# Altium schematic sheet 15_SOLENOID 2.SchDoc
size 420 x 297 mm; SheetNumber: 24; SheetTotal: 29
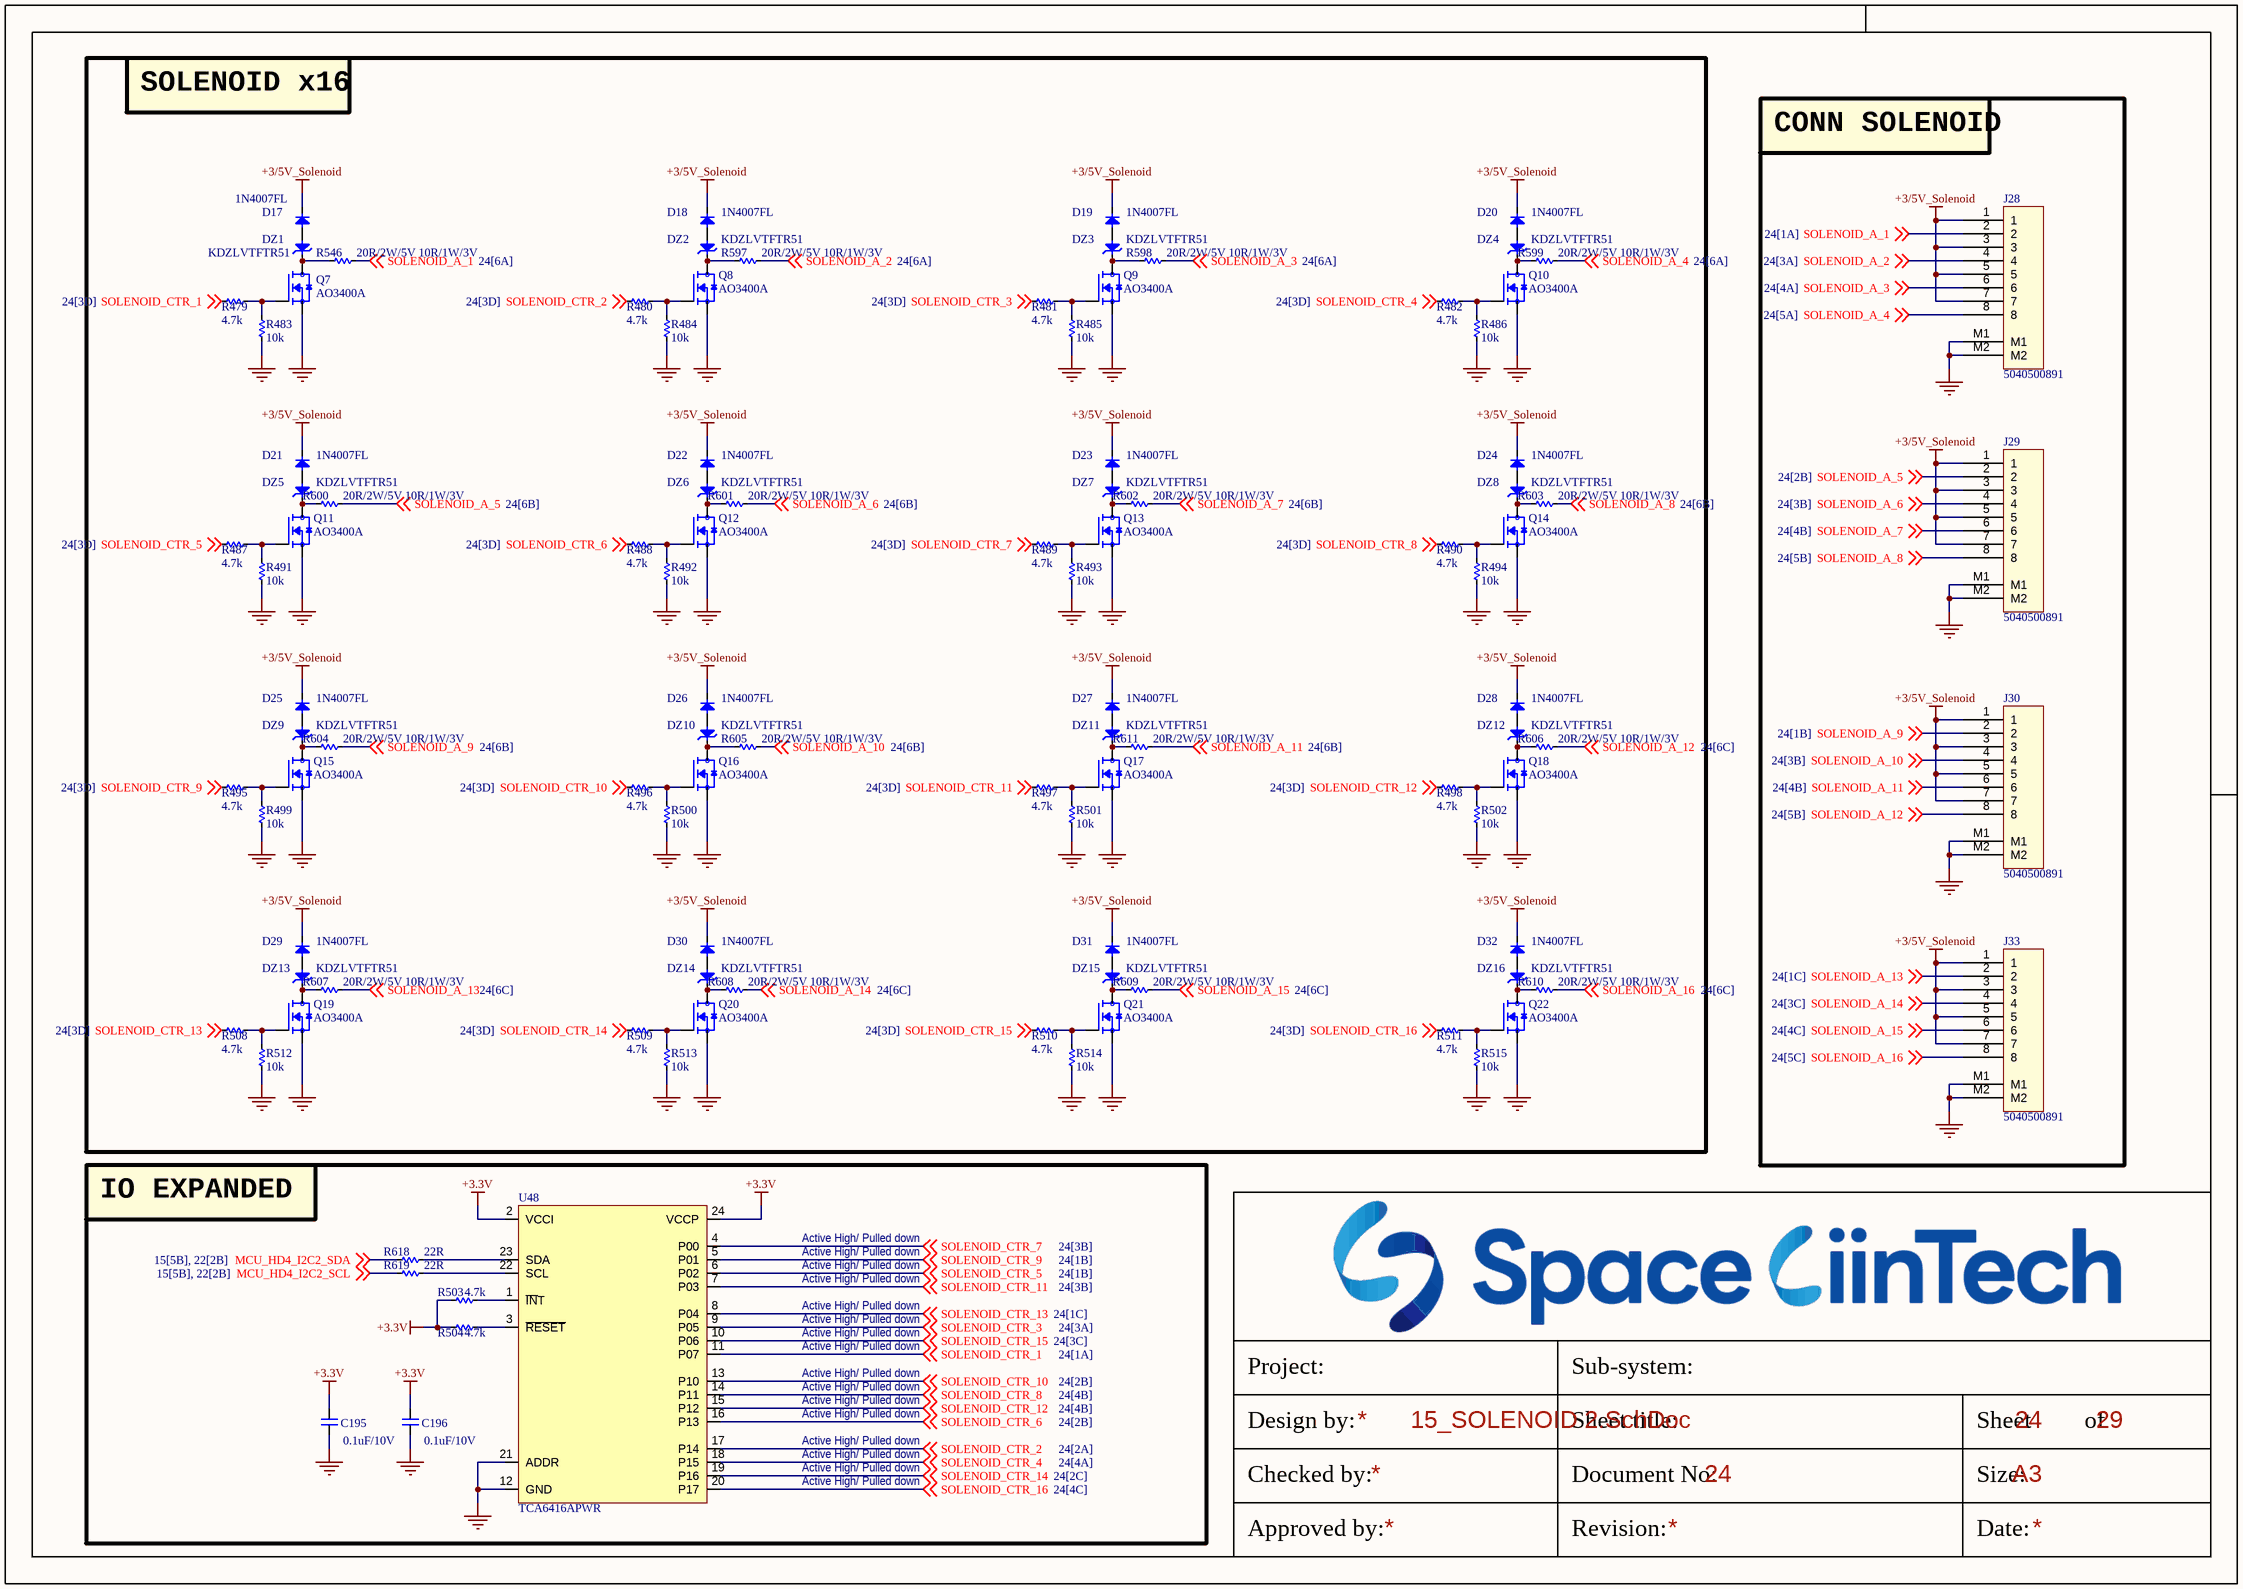
[diagram p0: 15_SOLENOID 2.SchDoc]

## Parts
C195  0.1uF/10V  [CAP_C_1005X60]
C196  0.1uF/10V  [CAP_C_1005X60]
D17  1N4007FL  [SOD3717X145N]
D18  1N4007FL  [SOD3717X145N]
D19  1N4007FL  [SOD3717X145N]
D20  1N4007FL  [SOD3717X145N]
D21  1N4007FL  [SOD3717X145N]
D22  1N4007FL  [SOD3717X145N]
D23  1N4007FL  [SOD3717X145N]
D24  1N4007FL  [SOD3717X145N]
D25  1N4007FL  [SOD3717X145N]
D26  1N4007FL  [SOD3717X145N]
D27  1N4007FL  [SOD3717X145N]
D28  1N4007FL  [SOD3717X145N]
D29  1N4007FL  [SOD3717X145N]
D30  1N4007FL  [SOD3717X145N]
D31  1N4007FL  [SOD3717X145N]
D32  1N4007FL  [SOD3717X145N]
DZ1  KDZLVTFTR51  [SOD3717X145N]
DZ2  KDZLVTFTR51  [SOD3717X145N]
DZ3  KDZLVTFTR51  [SOD3717X145N]
DZ4  KDZLVTFTR51  [SOD3717X145N]
DZ5  KDZLVTFTR51  [SOD3717X145N]
DZ6  KDZLVTFTR51  [SOD3717X145N]
DZ7  KDZLVTFTR51  [SOD3717X145N]
DZ8  KDZLVTFTR51  [SOD3717X145N]
DZ9  KDZLVTFTR51  [SOD3717X145N]
DZ10  KDZLVTFTR51  [SOD3717X145N]
DZ11  KDZLVTFTR51  [SOD3717X145N]
DZ12  KDZLVTFTR51  [SOD3717X145N]
DZ13  KDZLVTFTR51  [SOD3717X145N]
DZ14  KDZLVTFTR51  [SOD3717X145N]
DZ15  KDZLVTFTR51  [SOD3717X145N]
DZ16  KDZLVTFTR51  [SOD3717X145N]
J28  5040500891  [MOLEX_5040500891]
J29  5040500891  [MOLEX_5040500891]
J30  5040500891  [MOLEX_5040500891]
J33  5040500891  [MOLEX_5040500891]
Q7  AO3400A  [SOT95P240X120-3N]
Q8  AO3400A  [SOT95P240X120-3N]
Q9  AO3400A  [SOT95P240X120-3N]
Q10  AO3400A  [SOT95P240X120-3N]
Q11  AO3400A  [SOT95P240X120-3N]
Q12  AO3400A  [SOT95P240X120-3N]
Q13  AO3400A  [SOT95P240X120-3N]
Q14  AO3400A  [SOT95P240X120-3N]
Q15  AO3400A  [SOT95P240X120-3N]
Q16  AO3400A  [SOT95P240X120-3N]
Q17  AO3400A  [SOT95P240X120-3N]
Q18  AO3400A  [SOT95P240X120-3N]
Q19  AO3400A  [SOT95P240X120-3N]
Q20  AO3400A  [SOT95P240X120-3N]
Q21  AO3400A  [SOT95P240X120-3N]
Q22  AO3400A  [SOT95P240X120-3N]
R479  4.7k  [RES_C_1005X40]
R480  4.7k  [RES_C_1005X40]
R481  4.7k  [RES_C_1005X40]
R482  4.7k  [RES_C_1005X40]
R483  10k  [RES_C_1005X40]
R484  10k  [RES_C_1005X40]
R485  10k  [RES_C_1005X40]
R486  10k  [RES_C_1005X40]
R487  4.7k  [RES_C_1005X40]
R488  4.7k  [RES_C_1005X40]
R489  4.7k  [RES_C_1005X40]
R490  4.7k  [RES_C_1005X40]
R491  10k  [RES_C_1005X40]
R492  10k  [RES_C_1005X40]
R493  10k  [RES_C_1005X40]
R494  10k  [RES_C_1005X40]
R495  4.7k  [RES_C_1005X40]
R496  4.7k  [RES_C_1005X40]
R497  4.7k  [RES_C_1005X40]
R498  4.7k  [RES_C_1005X40]
R499  10k  [RES_C_1005X40]
R500  10k  [RES_C_1005X40]
R501  10k  [RES_C_1005X40]
R502  10k  [RES_C_1005X40]
R503  4.7k  [RES_C_1005X40]
R504  4.7k  [RES_C_1005X40]
R508  4.7k  [RES_C_1005X40]
R509  4.7k  [RES_C_1005X40]
R510  4.7k  [RES_C_1005X40]
R511  4.7k  [RES_C_1005X40]
R512  10k  [RES_C_1005X40]
R513  10k  [RES_C_1005X40]
R514  10k  [RES_C_1005X40]
R515  10k  [RES_C_1005X40]
R546  20R/2W/5V 10R/1W/3V  [RES_C_6331X65_N]
R597  20R/2W/5V 10R/1W/3V  [RES_C_6331X65_N]
R598  20R/2W/5V 10R/1W/3V  [RES_C_6331X65_N]
R599  20R/2W/5V 10R/1W/3V  [RES_C_6331X65_N]
R600  20R/2W/5V 10R/1W/3V  [RES_C_6331X65_N]
R601  20R/2W/5V 10R/1W/3V  [RES_C_6331X65_N]
R602  20R/2W/5V 10R/1W/3V  [RES_C_6331X65_N]
R603  20R/2W/5V 10R/1W/3V  [RES_C_6331X65_N]
R604  20R/2W/5V 10R/1W/3V  [RES_C_6331X65_N]
R605  20R/2W/5V 10R/1W/3V  [RES_C_6331X65_N]
R606  20R/2W/5V 10R/1W/3V  [RES_C_6331X65_N]
R607  20R/2W/5V 10R/1W/3V  [RES_C_6331X65_N]
R608  20R/2W/5V 10R/1W/3V  [RES_C_6331X65_N]
R609  20R/2W/5V 10R/1W/3V  [RES_C_6331X65_N]
R610  20R/2W/5V 10R/1W/3V  [RES_C_6331X65_N]
R611  20R/2W/5V 10R/1W/3V  [RES_C_6331X65_N]
R618  22R  [RES_C_1005X40]
R619  22R  [RES_C_1005X40]
U48  TCA6416APWR  [SOP65P440W-24N]

## Blocks framed on the sheet
SOLENOID x16: D17-D32 DZ1-DZ16 Q7-Q22 R479-R502 R508-R515 R546 R597-R611
CONN SOLENOID: J28-J30 J33
IO EXPANDED: C195 C196 R503 R504 R618 R619 U48

## Nets
+3.3V: C195.2 C196.2 R503.1 R504.1 U48.2(VCCI) U48.24(VCCP)
+3/5V_Solenoid: D17.1(K) D18.1(K) D19.1(K) D20.1(K) D21.1(K) D22.1(K) D23.1(K) D24.1(K) D25.1(K) D26.1(K) D27.1(K) D28.1(K) D29.1(K) D30.1(K) D31.1(K) D32.1(K) J28.1 J28.3 J28.5 J28.7 J29.1 J29.3 J29.5 J29.7 J30.1 J30.3 J30.5 J30.7 J33.1 J33.3 J33.5 J33.7
GND: C195.1 C196.1 J28.M1 J28.M2 J29.M1 J29.M2 J30.M1 J30.M2 J33.M1 J33.M2 Q7.2(S) Q8.2(S) Q9.2(S) Q10.2(S) Q11.2(S) Q12.2(S) Q13.2(S) Q14.2(S) Q15.2(S) Q16.2(S) Q17.2(S) Q18.2(S) Q19.2(S) Q20.2(S) Q21.2(S) Q22.2(S) R483.1 R484.1 R485.1 R486.1 R491.1 R492.1 R493.1 R494.1 R499.1 R500.1 R501.1 R502.1 R512.1 R513.1 R514.1 R515.1 U48.12(GND) U48.21(ADDR)
MCU_HD4_I2C2_SCL: R619.2 ; off-sheet MCU_HD4_I2C2_SCL
MCU_HD4_I2C2_SDA: R618.2 ; off-sheet MCU_HD4_I2C2_SDA
SOLENOID_A_1: J28.2 R546.1 ; off-sheet SOLENOID_A_1
SOLENOID_A_2: J28.4 R597.1 ; off-sheet SOLENOID_A_2
SOLENOID_A_3: J28.6 R598.1 ; off-sheet SOLENOID_A_3
SOLENOID_A_4: J28.8 R599.1 ; off-sheet SOLENOID_A_4
SOLENOID_A_5: J29.2 R600.1 ; off-sheet SOLENOID_A_5
SOLENOID_A_6: J29.4 R601.1 ; off-sheet SOLENOID_A_6
SOLENOID_A_7: J29.6 R602.1 ; off-sheet SOLENOID_A_7
SOLENOID_A_8: J29.8 R603.1 ; off-sheet SOLENOID_A_8
SOLENOID_A_9: J30.2 R604.1 ; off-sheet SOLENOID_A_9
SOLENOID_A_10: J30.4 R605.1 ; off-sheet SOLENOID_A_10
SOLENOID_A_11: J30.6 R611.1 ; off-sheet SOLENOID_A_11
SOLENOID_A_12: J30.8 R606.1 ; off-sheet SOLENOID_A_12
SOLENOID_A_13: J33.2 R607.1 ; off-sheet SOLENOID_A_13
SOLENOID_A_14: J33.4 R608.1 ; off-sheet SOLENOID_A_14
SOLENOID_A_15: J33.6 R609.1 ; off-sheet SOLENOID_A_15
SOLENOID_A_16: J33.8 R610.1 ; off-sheet SOLENOID_A_16
SOLENOID_CTR_1: R479.2 U48.11(P07) ; off-sheet SOLENOID_CTR_1
SOLENOID_CTR_2: R480.2 U48.17(P14) ; off-sheet SOLENOID_CTR_2
SOLENOID_CTR_3: R481.2 U48.9(P05) ; off-sheet SOLENOID_CTR_3
SOLENOID_CTR_4: R482.2 U48.18(P15) ; off-sheet SOLENOID_CTR_4
SOLENOID_CTR_5: R487.2 U48.6(P02) ; off-sheet SOLENOID_CTR_5
SOLENOID_CTR_6: R488.2 U48.16(P13) ; off-sheet SOLENOID_CTR_6
SOLENOID_CTR_7: R489.2 U48.4(P00) ; off-sheet SOLENOID_CTR_7
SOLENOID_CTR_8: R490.2 U48.14(P11) ; off-sheet SOLENOID_CTR_8
SOLENOID_CTR_9: R495.2 U48.5(P01) ; off-sheet SOLENOID_CTR_9
SOLENOID_CTR_10: R496.2 U48.13(P10) ; off-sheet SOLENOID_CTR_10
SOLENOID_CTR_11: R497.2 U48.7(P03) ; off-sheet SOLENOID_CTR_11
SOLENOID_CTR_12: R498.2 U48.15(P12) ; off-sheet SOLENOID_CTR_12
SOLENOID_CTR_13: R508.2 U48.8(P04) ; off-sheet SOLENOID_CTR_13
SOLENOID_CTR_14: R509.2 U48.19(P16) ; off-sheet SOLENOID_CTR_14
SOLENOID_CTR_15: R510.2 U48.10(P06) ; off-sheet SOLENOID_CTR_15
SOLENOID_CTR_16: R511.2 U48.20(P17) ; off-sheet SOLENOID_CTR_16
NetD17_2: D17.2(A) DZ1.2(A)
NetD18_2: D18.2(A) DZ2.2(A)
NetD19_2: D19.2(A) DZ3.2(A)
NetD20_2: D20.2(A) DZ4.2(A)
NetD21_2: D21.2(A) DZ5.2(A)
NetD22_2: D22.2(A) DZ6.2(A)
NetD23_2: D23.2(A) DZ7.2(A)
NetD24_2: D24.2(A) DZ8.2(A)
NetD25_2: D25.2(A) DZ9.2(A)
NetD26_2: D26.2(A) DZ10.2(A)
NetD27_2: D27.2(A) DZ11.2(A)
NetD28_2: D28.2(A) DZ12.2(A)
NetD29_2: D29.2(A) DZ13.2(A)
NetD30_2: D30.2(A) DZ14.2(A)
NetD31_2: D31.2(A) DZ15.2(A)
NetD32_2: D32.2(A) DZ16.2(A)
NetDZ1_1: DZ1.1(K) Q7.3(D) R546.2
NetDZ2_1: DZ2.1(K) Q8.3(D) R597.2
NetDZ3_1: DZ3.1(K) Q9.3(D) R598.2
NetDZ4_1: DZ4.1(K) Q10.3(D) R599.2
NetDZ5_1: DZ5.1(K) Q11.3(D) R600.2
NetDZ6_1: DZ6.1(K) Q12.3(D) R601.2
NetDZ7_1: DZ7.1(K) Q13.3(D) R602.2
NetDZ8_1: DZ8.1(K) Q14.3(D) R603.2
NetDZ9_1: DZ9.1(K) Q15.3(D) R604.2
NetDZ10_1: DZ10.1(K) Q16.3(D) R605.2
NetDZ11_1: DZ11.1(K) Q17.3(D) R611.2
NetDZ12_1: DZ12.1(K) Q18.3(D) R606.2
NetDZ13_1: DZ13.1(K) Q19.3(D) R607.2
NetDZ14_1: DZ14.1(K) Q20.3(D) R608.2
NetDZ15_1: DZ15.1(K) Q21.3(D) R609.2
NetDZ16_1: DZ16.1(K) Q22.3(D) R610.2
NetQ7_1: Q7.1(G) R479.1 R483.2
NetQ8_1: Q8.1(G) R480.1 R484.2
NetQ9_1: Q9.1(G) R481.1 R485.2
NetQ10_1: Q10.1(G) R482.1 R486.2
NetQ11_1: Q11.1(G) R487.1 R491.2
NetQ12_1: Q12.1(G) R488.1 R492.2
NetQ13_1: Q13.1(G) R489.1 R493.2
NetQ14_1: Q14.1(G) R490.1 R494.2
NetQ15_1: Q15.1(G) R495.1 R499.2
NetQ16_1: Q16.1(G) R496.1 R500.2
NetQ17_1: Q17.1(G) R497.1 R501.2
NetQ18_1: Q18.1(G) R498.1 R502.2
NetQ19_1: Q19.1(G) R508.1 R512.2
NetQ20_1: Q20.1(G) R509.1 R513.2
NetQ21_1: Q21.1(G) R510.1 R514.2
NetQ22_1: Q22.1(G) R511.1 R515.2
NetR503_2: R503.2 U48.1(~{IN}T)
NetR504_2: R504.2 U48.3(~{RESET})
NetR618_1: R618.1 U48.23(SDA)
NetR619_1: R619.1 U48.22(SCL)

## Notes on the sheet
- Active High/ Pulled down
- Project:
- Sub-system:
- Design by:
- Sheet title:
- Sheet
- of
- Checked by:
- Approved by:
- Revision:
- Document No:
- Size:
- Date:
- A3

## Library data of the parts
C195 C196 = _CAP_C_2: CAP CHIP
D17-D32 = Diode SMD: Default Diode; Code - JEDEC: DO-214-AB; Value: 1N5007; Published: 8-Jun-2000; Revision: July-2002: Re-released for DXP Platform.; Publisher: Altium Limited
DZ1-DZ16 = DIODE Zener: Zenner
J28-J30 J33 = Header 8x1_2M
Q7-Q22 = MOSFET_N: N-Channel 30 V 5.7A (Ta) 1.4W (Ta) Surface Mount SOT-23-3; MF: Alpha & Omega Semiconductor; SnapEDA_Link: https://www.snapeda.com/parts/AO3400A/Alpha/view-part/?ref=snap; Package: SOT-23 Alpha &amp; Omega Semiconductor Inc.; Value: *; MP: AO3400A; Check_prices: https://www.snapeda.com/parts/AO3400A/Alpha/view-part/?ref=eda
R479-R504 R508-R515 R546 R597-R611 R618 R619 = _RES_B_2: RES
U48 = IC_I2Cto16IO_TCA6416APWR